# EAGLE design H (EAGLE 9.6.2)
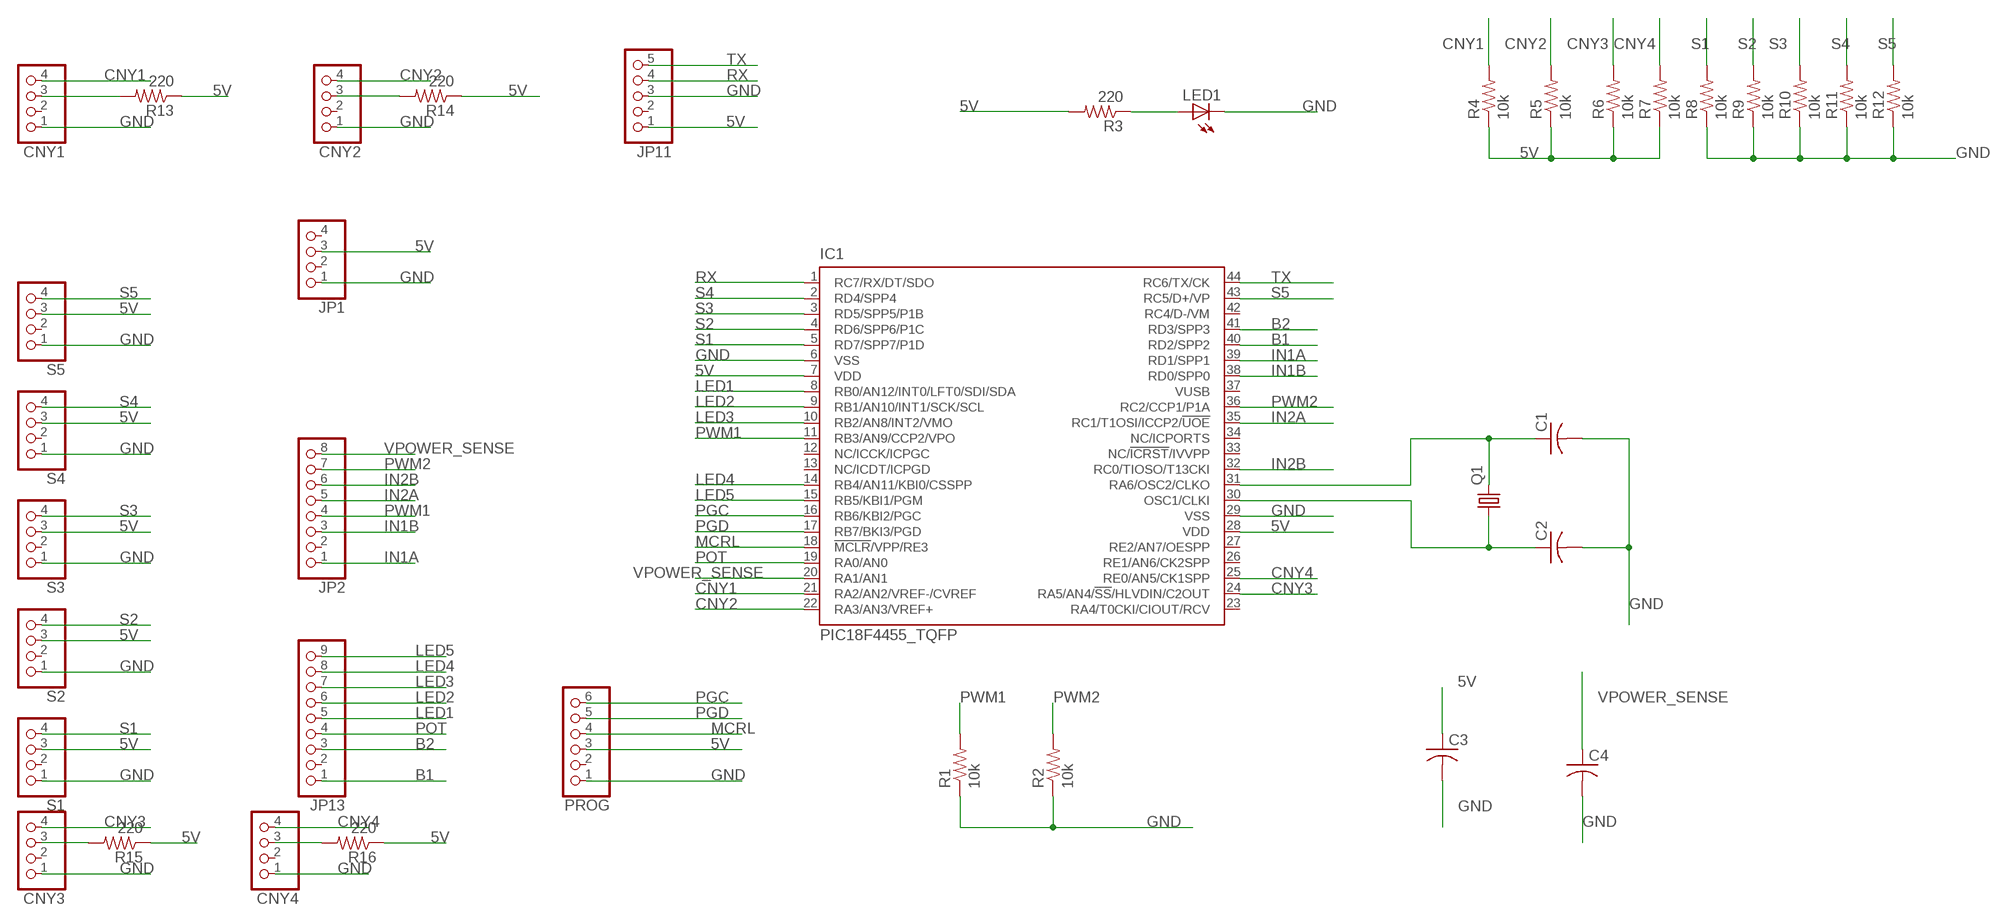
[diagram p0: schematic, sheet 1]

## Parts
C1  C-USC0805K  [C0805K]
C2  C-USC0805K  [C0805K]
C3  C-USC0805K  [C0805K]
C4  C-USC0805K  [C0805K]
CNY1  PINHD-1X4/90  [1X04/90]
CNY2  PINHD-1X4/90  [1X04/90]
CNY3  PINHD-1X4/90  [1X04/90]
CNY4  PINHD-1X4/90  [1X04/90]
IC1  PIC18F4455_TQFP  [TQFP44]
JP1  PINHD-1X4/90  [1X04/90]
JP2  PINHD-1X8/90  [1X08/90]
JP11  PINHD-1X5/90  [1X05/90]
JP13  PINHD-1X9/90  [1X09/90]
LED1  LEDCHIPLED_1206  [CHIPLED_1206]
PROG  PINHD-1X6/90  [1X06/90]
Q1  CRYSTALHC49S  [HC49/S]
R1  10k  R-US_M1206  [M1206]
R2  10k  R-US_M1206  [M1206]
R3  220  R-US_M1206  [M1206]
R4  10k  R-US_M1206  [M1206]
R5  10k  R-US_M1206  [M1206]
R6  10k  R-US_M1206  [M1206]
R7  10k  R-US_M1206  [M1206]
R8  10k  R-US_M1206  [M1206]
R9  10k  R-US_M1206  [M1206]
R10  10k  R-US_M1206  [M1206]
R11  10k  R-US_M1206  [M1206]
R12  10k  R-US_M1206  [M1206]
R13  220  R-US_M1206  [M1206]
R14  220  R-US_M1206  [M1206]
R15  220  R-US_M1206  [M1206]
R16  220  R-US_M1206  [M1206]
S1  PINHD-1X4/90  [1X04/90]
S2  PINHD-1X4/90  [1X04/90]
S3  PINHD-1X4/90  [1X04/90]
S4  PINHD-1X4/90  [1X04/90]
S5  PINHD-1X4/90  [1X04/90]

## Nets
5V: C3.1 IC1.7(VDD) IC1.28(VDD) JP1.3 JP11.1 PROG.3 R3.2 R4.1 R5.1 R6.1 R7.1 R13.1 R14.1 R15.1 R16.1 S1.3 S2.3 S3.3 S4.3 S5.3
B1: IC1.40(RD2/SPP2) JP13.1
B2: IC1.41(RD3/SPP3) JP13.3
CNY1: CNY1.4 IC1.21(RA2/AN2/VREF-/CVREF) R4.2
CNY2: CNY2.4 IC1.22(RA3/AN3/VREF+) R5.2
CNY3: CNY3.4 IC1.24(RA5/AN4/!SS!/HLVDIN/C2OUT) R6.2
CNY4: CNY4.4 IC1.25(RE0/AN5/CK1SPP) R7.2
GND: C1.2 C2.2 C3.2 C4.2 CNY1.1 CNY2.1 CNY3.1 CNY4.1 IC1.6(VSS) IC1.29(VSS) JP1.1 JP11.3 LED1.C PROG.1 R1.1 R2.1 R8.1 R9.1 R10.1 R11.1 R12.1 S1.1 S2.1 S3.1 S4.1 S5.1
IN1A: IC1.39(RD1/SPP1) JP2.1
IN1B: IC1.38(RD0/SPP0) JP2.3
IN2A: IC1.35(RC1/T1OSI/ICCP2/!UOE) JP2.5
IN2B: IC1.32(RC0/TIOSO/T13CKI) JP2.6
LED1: IC1.8(RB0/AN12/INT0/LFT0/SDI/SDA) JP13.5
LED2: IC1.9(RB1/AN10/INT1/SCK/SCL) JP13.6
LED3: IC1.10(RB2/AN8/INT2/VMO) JP13.7
LED4: IC1.14(RB4/AN11/KBI0/CSSPP) JP13.8
LED5: IC1.15(RB5/KBI1/PGM) JP13.9
MCRL: IC1.18(!MCLR!/VPP/RE3) PROG.4
N$1: C1.1 IC1.31(RA6/OSC2/CLKO) Q1.2
N$2: C2.1 IC1.30(OSC1/CLKI) Q1.1
N$3: LED1.A R3.1
N$4: CNY1.3 R13.2
N$5: CNY2.3 R14.2
N$6: CNY3.3 R15.2
N$7: CNY4.3 R16.2
PGC: IC1.16(RB6/KBI2/PGC) PROG.6
PGD: IC1.17(RB7/BKI3/PGD) PROG.5
POT: IC1.19(RA0/AN0) JP13.4
PWM1: IC1.11(RB3/AN9/CCP2/VPO) JP2.4 R1.2
PWM2: IC1.36(RC2/CCP1/P1A) JP2.7 R2.2
RX: IC1.1(RC7/RX/DT/SDO) JP11.4
S1: IC1.5(RD7/SPP7/P1D) R8.2 S1.4
S2: IC1.4(RD6/SPP6/P1C) R9.2 S2.4
S3: IC1.3(RD5/SPP5/P1B) R10.2 S3.4
S4: IC1.2(RD4/SPP4) R11.2 S4.4
S5: IC1.43(RC5/D+/VP) R12.2 S5.4
TX: IC1.44(RC6/TX/CK) JP11.5
VPOWER_SENSE: C4.1 IC1.20(RA1/AN1) JP2.8
Unconnected: CNY1.2 CNY2.2 CNY3.2 CNY4.2 IC1.12(NC/ICCK/ICPGC) IC1.13(NC/ICDT/ICPGD) IC1.23(RA4/T0CKI/CIOUT/RCV) IC1.26(RE1/AN6/CK2SPP) IC1.27(RE2/AN7/OESPP) IC1.33(NC/!ICRST!/IVVPP) IC1.34(NC/ICPORTS) IC1.37(VUSB) IC1.42(RC4/D-/VM) JP1.2 JP1.4 JP2.2 JP11.2 JP13.2 PROG.2 S1.2 S2.2 S3.2 S4.2 S5.2

## Library data of the parts
C1-C4 = adafruit:C-US: CAPACITOR, American symbol
CNY1 CNY2 JP1 S1-S5 = pinhead-enhanced:PINHD-1X4: PIN HEADER
CNY3 CNY4 = pinhead-enhanced-3:PINHD-1X4: PIN HEADER
IC1 = microchip:PIC18F4*_TQFP: USB Microcontrollers with nanoWatt Technology High-Performance, Enhanced Flash, 28/40/44-Pin, Source: http://ww1.microchip.com/downloads/en/devicedoc/39632c.pdf; MF: MICROCHIP; MPN: PIC18F4455-I/PT; OC_FARNELL: 9321322; OC_NEWARK: 08J9628
JP2 = pinhead-enhanced-2:PINHD-1X8: PIN HEADER
JP11 = pinhead-enhanced-3:PINHD-1X5: PIN HEADER
JP13 = pinhead-enhanced-3:PINHD-1X9: PIN HEADER
LED1 = adafruit:LED: LED OSRAM: - CHIPLED LG R971, LG N971, LY N971, LG Q971, LY Q971, LO R971, LY R971 LH N974, LH R974 LS Q976, LO Q976, LY Q976 LO Q996 - Hyper CHIPLED LW Q18S LB Q993, LB Q99A, LB R99A - SideLED LS A670, LO A670, LY A670, LG A670, LP A670 LB A673, LV A673, LT A673, LW A673 LH A674 LY A675 LS A676, LA A676, LO A676, LY A676, LW A676 LS A679, LY A679, LG A679 - Hyper Micro SIDELED® LS Y876, LA Y876, LO Y876, LY Y876 LT Y87S - SmartLED LW L88C, LW L88S LB L89C, LB L89S, LG L890 LS L89K, LO L89K, LY L89K LS L896, LA L896, LO L896, LY L896 - TOPLED LS T670, LO T670, LY T670, LG T670, LP T670 LSG T670, LSP T670, LSY T670, LOP T670, LYG T670 LG T671, LOG T671, LSG T671 LB T673, LV T673, LT T673, LW T673 LH T674 LS T676, LA T676, LO T676, LY T676, LB T676, LH T676, LSB T676, LW T676 LB T67C, LV T67C, LT T67C, LS T67K, LO T67K, LY T67K, LW E67C LS E67B, LA E67B, LO E67B, LY E67B, LB E67C, LV E67C, LT E67C LW T67C LS T679, LY T679, LG T679 LS T770, LO T770, LY T770, LG T770, LP T770 LB T773, LV T773, LT T773, LW T773 LH T774 LS E675, LA E675, LY E675, LS T675 LS T776, LA T776, LO T776, LY T776, LB T776 LHGB T686 LT T68C, LB T68C - Hyper Mini TOPLED® LB M676 - Mini TOPLED Santana® LG M470 LS M47K, LO M47K, LY M47K Source: http://www.osram.convergy.de/
PROG = pinhead-enhanced-2:PINHD-1X6: PIN HEADER
Q1 = crystal:CRYSTAL: CRYSTAL; OC_FARNELL: 1667008; OC_NEWARK: unknown
R1-R16 = adafruit:R-US_: RESISTOR, American symbol

## Board
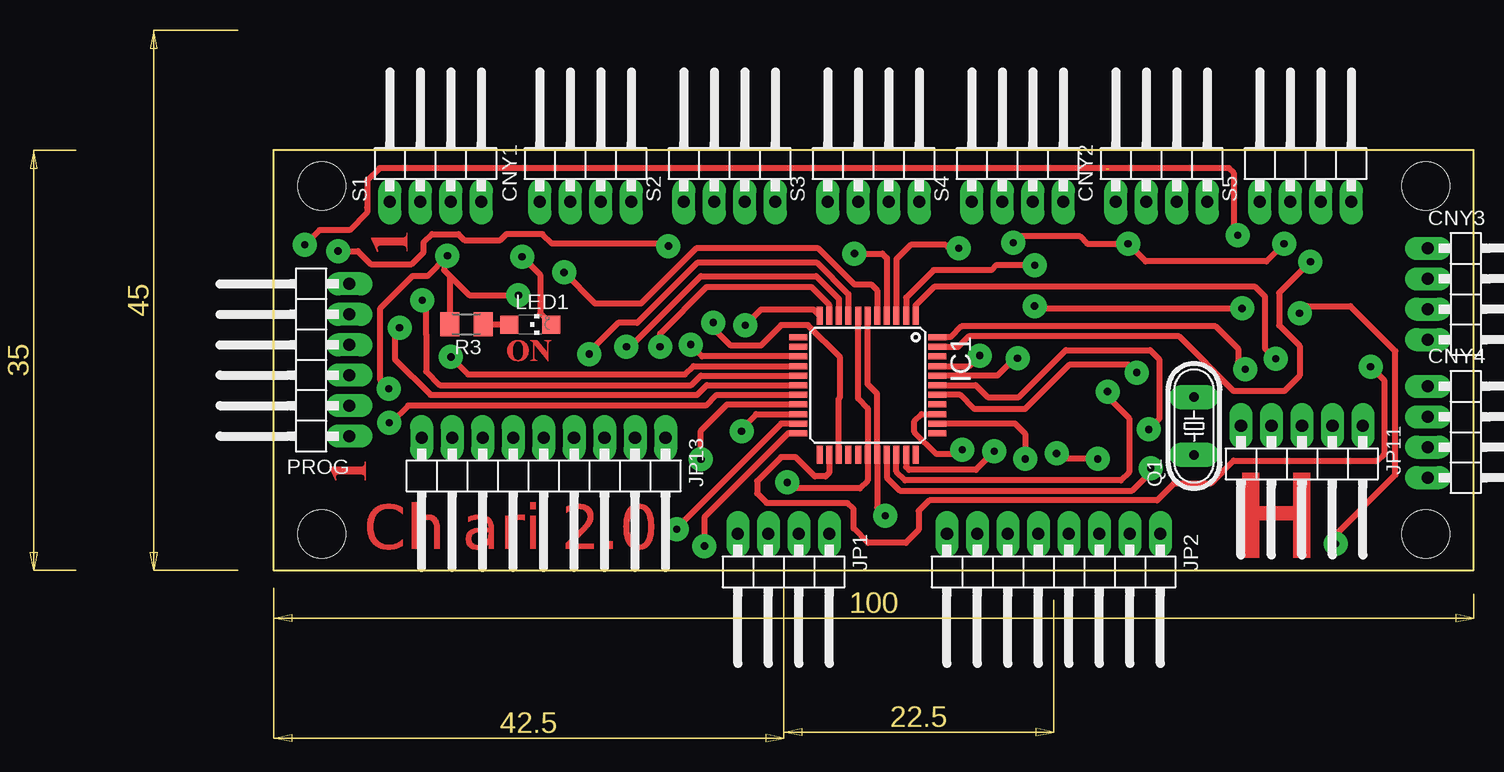
[diagram p1: board, top side]
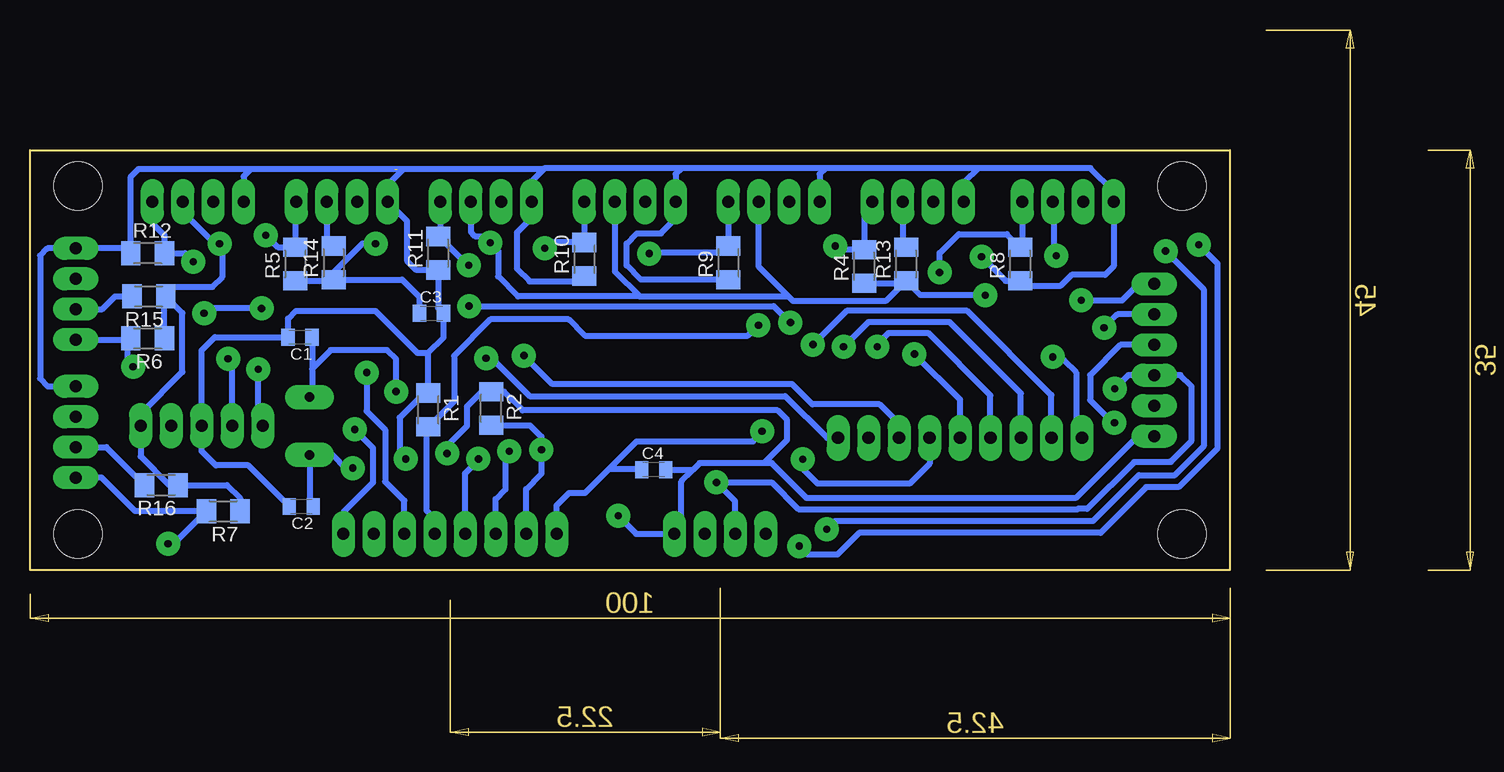
[diagram p2: board, bottom side, seen from below]

Size 100 x 35 mm. Coordinates in mm from the lower left corner, seen from the top.
Outline: 0,0 0,35 100,35 100,0 0,0
Copper layers (1*16): Top 0.035mm / dielectric 1.5mm / Bottom 0.035mm
Design rules "default *": minimum track width 6mil, minimum drill 0.35mm, track to track 6mil, track to pad 6mil, pad to pad 6mil, via to via 6mil, smd to smd 6mil, copper to edge 20mil, drill to drill 6mil, minimum pad ring 10mil, minimum via ring 8mil, stop-mask expansion 4mil, vias tented up to drill 0mil, thermal gap 10mil
Holes 4 mm at 4,32 4,3 96,3 96,32

### Footprints (pad centres in the part's own frame; a part is rotated, then mirrored left to right if it is on the bottom)
C0805K = smd 1.1 x 1.4: 1 -1,0; 2 1,0
1X04/90 = drill 1.016 pad 1.905 long: 1 -3.81,-3.81; 2 -1.27,-3.81; 3 1.27,-3.81; 4 3.81,-3.81
TQFP44 = smd 1.5 x 0.5: 1 -5.8,4; 2 -5.8,3.2; 3 -5.8,2.4; 4 -5.8,1.6; 5 -5.8,0.8; 6 -5.8,0; 7 -5.8,-0.8; 8 -5.8,-1.6; 9 -5.8,-2.4; 10 -5.8,-3.2; 11 -5.8,-4; 23 5.8,-4; 24 5.8,-3.2; 25 5.8,-2.4; 26 5.8,-1.6; 27 5.8,-0.8; 28 5.8,0; 29 5.8,0.8; 30 5.8,1.6; 31 5.8,2.4; 32 5.8,3.2; 33 5.8,4 | smd 0.5 x 1.5: 12 -4,-5.8; 13 -3.2,-5.8; 14 -2.4,-5.8; 15 -1.6,-5.8; 16 -0.8,-5.8; 17 0,-5.8; 18 0.8,-5.8; 19 1.6,-5.8; 20 2.4,-5.8; 21 3.2,-5.8; 22 4,-5.8; 34 4,5.8; 35 3.2,5.8; 36 2.4,5.8; 37 1.6,5.8; 38 0.8,5.8; 39 0,5.8; 40 -0.8,5.8; 41 -1.6,5.8; 42 -2.4,5.8; 43 -3.2,5.8; 44 -4,5.8
1X08/90 = drill 1.016 pad 1.905 long: 1 -8.89,-3.81; 2 -6.35,-3.81; 3 -3.81,-3.81; 4 -1.27,-3.81; 5 1.27,-3.81; 6 3.81,-3.81; 7 6.35,-3.81; 8 8.89,-3.81
1X05/90 = drill 1.016 pad 1.905 long: 1 -5.08,-3.81; 2 -2.54,-3.81; 3 0,-3.81; 4 2.54,-3.81; 5 5.08,-3.81
1X09/90 = drill 1.016 pad 1.905 long: 1 -10.16,-3.81; 2 -7.62,-3.81; 3 -5.08,-3.81; 4 -2.54,-3.81; 5 0,-3.81; 6 2.54,-3.81; 7 5.08,-3.81; 8 7.62,-3.81; 9 10.16,-3.81
CHIPLED_1206 = smd 1.5 x 1.5: A 0,-1.75; C 0,1.75
1X06/90 = drill 1.016 pad 1.905 long: 1 -6.35,-3.81; 2 -3.81,-3.81; 3 -1.27,-3.81; 4 1.27,-3.81; 5 3.81,-3.81; 6 6.35,-3.81
HC49/S = drill 0.813 pad 2.032 long: 1 -2.413,0; 2 2.413,0
M1206 = smd 1.6 x 2: 1 -1.4,0; 2 1.4,0

### Placement (x,y rotation side)
C1  77.5,19.4 180 bottom
C2  77.4,5.3 180 bottom
C3  66.54,21.39 0 bottom
C4  48.03,8.36 0 bottom
CNY1  26,34.5 0 top
CNY2  74,34.5 0 top
CNY3  100,23 270 top
CNY4  100,11.5 270 top
IC1  49.5,15.4 270 top
JP1  42.5,-0.8 180 top
JP2  65,-0.8 180 top
JP11  85.7,8.22 180 top
JP13  22.5,7.2 180 top
LED1  21.38,20.46 270 top
PROG  2.5,17.5 90 top
Q1  76.7,12 90 top
R1  66.81,13.34 270 bottom
R2  61.58,13.46 270 bottom
R3  16.07,20.49 180 top
R4  30.5,25.3 90 bottom
R5  77.9,25.5 90 bottom
R6  90.2,19.3 180 bottom
R7  83.9,4.9 180 bottom
R8  17.5,25.5 90 bottom
R9  41.8,25.6 90 bottom
R10  53.8,25.9 90 bottom
R11  66,26.4 90 bottom
R12  90.2,26.4 0 bottom
R13  27,25.5 90 bottom
R14  74.7,25.6 90 bottom
R15  90.1,22.8 180 bottom
R16  89.07,7.08 180 bottom
S1  13.5,34.5 0 top
S2  38,34.5 0 top
S3  50,34.5 0 top
S4  62,34.5 0 top
S5  86,34.5 0 top

### Tracks (layer width: path | path; a pad name or v marks a point on that pad's centre or on a via)
5V  (via drill 0.6 pad 2)
  Top 0.5: IC1.7 48.7,14.3 49.5,13.5 IC1.28 49.5,7.45 48.85,6.8 43.3,6.8 v42.8,7.3 | 14.67,24.53 R3.2 | 14.67,24.53 14.2,25 14.2,26.19 v14.49,26.19 12.79,24.49 11.57,24.49 8.9,21.82 8.9,15.8 v9.6,15.1 | 14.67,24.53 16.3,22.9 v20.4,22.9 | v61.64,27.27 62.17,27.8 67.2,27.8 67.8,27.2 v71.2,27.2 72.67,25.73 82.73,25.73 v84.2,27.2
  Bottom 0.5: S5.3 87.27,29.87 84.4,27 v84.2,27.2 84,27.2 84,24.4 84.8,23.6 87.9,23.6 R15.1 87.3,21.4 87.3,16.52 90.78,13.04 JP11.1 90.78,9.47 88.38,7.08 R16.1 | JP1.3 41.23,5.73 v42.8,7.3 38.2,7.3 35.97,5.07 12.7,5.07 12.68,5.1 11.9,5.1 8,9 4.9,9 4.9,9.07 3.2,10.78 3.2,15.3 4.13,16.23 PROG.3 8.47,16.23 v9.6,15.1 | v14.49,26.19 14.69,26.39 14.69,30.61 S1.3 | v20.4,22.9 25.8,22.9 R13.1 28.7,22.4 36.4,22.4 36.8,22.8 | S2.3 39.27,25.27 36.8,22.8 | S3.3 51.27,24.87 49.2,22.8 | 49.2,22.8 36.8,22.8 | C3.1 67.54,22.74 69,24.2 R14.1 75.3,24.2 72.3,27.2 v71.2,27.2 | S4.3 63.27,28.17 62.93,27.83 62.2,27.83 v61.64,27.27 61,26.63 61,24.46 59.34,22.8 49.2,22.8
  Bottom 0.508: R4.1 27.2,23.9 R13.1 | R5.1 74.8,24.1 R14.1 | R6.1 88.8,22.7 R15.1 | R16.1 83.58,7.08 82.5,6 R7.1
B1  (via drill 0.6 pad 2)
  Top 0.5: v62,17.65 61.76,17.65 60.31,16.2 IC1.40
  Bottom 0.5: JP13.1 33.58,11.01 37.07,14.5 58.37,14.5 61.52,17.65 v62,17.65
B2  (via drill 0.6 pad 2)
  Top 0.5: IC1.41 57.97,17 v58.84,17.88
  Bottom 0.5: JP13.3 27.58,12.18 29.2,13.8 34.8,13.8 36.5,15.5 56.47,15.5 v58.84,17.88
CNY1  (via drill 0.6 pad 2)
  Top 0.5: IC1.21 42.3,12.2 33.6,3.5 v33.6,3.4 | v5.37,26.58 7.02,26.58 8.1,25.5 11.5,25.5 12.5,26.5 12.5,27.3 13.2,28 15.4,28 15.9,27.5 18.9,27.5 19.4,28 22.4,28 23.2,27.2 32.7,27.2 v32.9,27
  Bottom 0.5: CNY1.4 30.5,30 R4.2 32.6,26.7 v32.9,27 | v33.6,3.4 32.9,4.1 11.4,4.1 7.6,7.9 4.6,7.9 2.2,10.3 2.2,23.4 v5.37,26.58
CNY2  (via drill 0.6 pad 2)
  Top 0.5: IC1.22 42.9,11.4 35.89,4.39 v35.89,2.01 v35.9,2 | 7.8,30.2 7.84,30.24 | v80.35,27.9 80.35,28.25 80,28.6 80,33.1 79.6,33.5 8.83,33.5 7.8,32.47 7.8,30.2 | v2.6,27.1 3.83,28.32 6.33,28.32 7.8,29.8 7.8,30.2
  Bottom 0.5: CNY2.4 77.9,30.6 R5.2 79.35,26.9 v80.35,27.9 | v35.9,2 35.2,1.3 32.7,1.3 30.9,3.1 10.79,3.1 6.99,6.9 4.29,6.9 1.03,10.15 1.03,25.53 v2.6,27.1
CNY3  (via drill 0.6 pad 2)
  Top 0.5: v91.42,16.94 92.54,15.82 92.54,9.66 91.98,9.11 79.99,9.11 78.12,7.24 75.06,7.24 73.63,5.81 54.65,5.81 53.76,4.92 53.76,3.35 52.68,2.27 49.53,2.27 48.33,3.47 48.33,5.09 47.82,5.6 41.08,5.6 40.3,6.38 40.3,7.4 42.3,9.4 43.5,9.4 45.1,7.8 46,7.8 46.3,8.1 IC1.24
  Bottom 0.5: CNY3.4 91.71,19.19 R6.2 91.9,19 91.9,17.43 v91.42,16.94
CNY4  (via drill 0.6 pad 2)
  Top 0.5: v88.49,2.18 88.49,2.94 93.49,7.93 93.49,18.24 89.72,22 86.1,22 v85.5,21.4 | IC1.25 47.1,14.3 47.2,14.4 47.2,17.73 44.52,20.4 42.3,20.4 40.6,18.7 38.1,18.7 36.4,20.4 v36.63,20.62 | v63.41,22 63.61,21.8 v80.7,21.8
  Bottom 0.5: 95.59,7.69 CNY4.4 94.03,7.69 91.24,4.9 R7.2 | 85.3,5.2 R7.2 | R7.2 88.02,2.18 v88.49,2.18 | v36.63,20.62 36.66,20.62 38.03,22 v63.41,22 | v80.7,21.8 85.1,21.8 v85.5,21.4
GND  (via drill 0.6 pad 2)  (1 unrouted)
  Top 0.5: IC1.6 49.5,15.5 50.3,14.7 IC1.29 50.3,5.2 v50.98,4.52 | LED1.C 22.2,21.38 22.2,24.6 v20.7,26.1
  Top 0.508: v68.68,9.26 65.7,9.26 v65.25,9.71
  Bottom 0.5: 61.77,15.05 R2.1 | R1.1 66.31,15.24 | 61.68,14.96 R2.1 | JP11.3 85.69,18.3 84.6,19.4 C1.2 78.47,19.43 | PROG.1 7.71,11.15 12.86,6 35.27,6 38.17,8.9 38.84,8.9 | 38.84,8.9 44.2,8.9 44.74,8.36 | R8.1 17.3,24.3 | 21,33.5 11.64,33.5 9.69,31.55 S1.1 9.69,25.31 10.4,24.6 13.2,24.6 14.1,23.7 17.1,23.7 R8.1 | CNY1.1 22.19,32.31 21,33.5 | 21,33.5 33.7,33.5 | S2.1 34.19,33.01 33.7,33.5 | 33.7,33.5 45.7,33.5 | 45.7,33.5 46.19,33.01 S3.1 46.19,29.29 47.44,28.05 49.43,28.05 50.28,27.2 50.28,25.38 49.1,24.2 R9.1 | 45.7,33.5 57.1,33.5 57.2,33.4 | 57.2,33.4 58.19,32.41 S4.1 58.19,29.35 59.42,28.12 59.42,25.12 58.36,24.06 54.24,24.06 R10.1 | 57.2,33.4 68.9,33.4 | 68.9,33.4 69.6,33.4 | 69.4,33.4 81.6,33.4 | S5.1 82.19,32.81 81.6,33.4 | 81.6,33.4 90.96,33.4 91.64,32.72 91.64,26.44 R12.1 92.01,26.81 CNY3.1 98.56,26.81 99.17,26.2 99.17,15.97 98.51,15.31 CNY4.1 | v20.7,26.1 18.7,24.1 R8.1 | R11.1 67.8,25 68.59,25.79 68.59,29.09 CNY2.1 70.19,32.11 68.9,33.4 | R1.1 66.81,18.1 65.54,19.37 C3.2 66,21.85 R11.1 | 65.6,24.6 R11.1 | v50.98,4.52 49.48,3.02 JP1.1 45.71,3.61 45.71,7.39 44.74,8.36 | R2.1 60.51,14.86 58.96,13.3 37.7,13.3 36.9,12.51 36.9,10.84 38.84,8.9 | R2.1 62.35,14.86 63.6,13.61 63.6,11.99 65.25,10.34 v65.25,9.71 | R1.1 67.15,14.74 69.2,12.69 69.2,9.81 68.68,9.29 v68.68,9.26 | C4.2 44.74,8.36
  Bottom 0.508: C2.2 81.81,8.71 84.51,8.71 85.69,9.9 JP11.3 | C1.2 78.5,20.94 77.85,21.59 71.22,21.59 67.73,18.1 66.81,18.1
IN1A  (via drill 0.6 pad 2)
  Top 0.5: v72.93,11.71 73.8,12.58 73.8,17.58 73.05,18.33 66.03,18.33 62.1,14.4 59.5,14.4 58.5,15.4 IC1.39
  Bottom 0.5: JP2.1 73.89,4.81 71.4,7.3 71.4,10.16 72.93,11.69 v72.93,11.71
IN1B  (via drill 0.6 pad 2)
  Top 0.5: v71.94,16.45 71.29,17.1 66.3,17.1 62.6,13.4 58.4,13.4 57.2,14.6 IC1.38
  Bottom 0.5: v71.94,16.45 71.94,13.24 70.4,11.7 70.4,7.36 68.81,5.77 JP2.3
IN2A  (via drill 0.6 pad 2)
  Top 0.5: IC1.35 61.8,12.2 62.63,11.37 v62.63,9.26
  Bottom 0.5: JP2.5 63.73,8.05 62.63,9.14 v62.63,9.26
IN2B  (via drill 0.6 pad 2)
  Top 0.5: IC1.32 52.7,8.6 52.96,8.34 58.52,8.34 v60.06,9.89
  Bottom 0.5: JP2.6 61.19,5.91 60.39,6.71 60.39,9.89 v60.06,9.89
LED1  (via drill 0.6 pad 2)
  Top 0.5: v26.3,18 26.3,18.2 28.7,20.6 30.3,20.6 35.3,25.6 45.3,25.6 47.9,23 IC1.8
  Bottom 0.5: JP13.5 22.5,14.2 v26.3,18
LED2  (via drill 0.6 pad 2)
  Top 0.5: v29.4,18.6 29.7,18.6 35.6,24.5 45.2,24.5 47.1,22.6 IC1.9
  Bottom 0.5: JP13.6 19.96,14.56 25.15,19.75 28.45,19.75 29.4,18.8 v29.4,18.6
LED3  (via drill 0.6 pad 2)
  Top 0.5: v32.2,18.6 32.2,19.7 36.1,23.6 44.8,23.6 46.3,22.1 IC1.10
  Bottom 0.5: JP13.7 17.42,14.72 23.38,20.68 30.12,20.68 v32.2,18.6
LED4  (via drill 0.6 pad 2)
  Top 0.5: IC1.14 35.7,17.8 34.73,18.77 v34.76,18.79
  Bottom 0.5: JP13.8 14.88,14.58 21.9,21.6 31.95,21.6 v34.76,18.79
LED5  (via drill 0.6 pad 2)
  Top 0.5: v14.78,17.76 14.78,17.72 16.2,16.3 34.3,16.3 35,17 IC1.15
  Bottom 0.5: JP13.9 12.82,11.49 12.82,16.48 13.84,17.5 14.78,17.5 v14.78,17.76
MCRL  (via drill 0.6 pad 2)
  Top 0.5: v9.63,12.28 9.78,12.28 11.2,13.7 36,13.7 36.9,14.6 IC1.18
  Bottom 0.5: PROG.4 9.13,18.77 11.66,16.24 11.66,14.16 9.78,12.28 v9.63,12.28
N$1  (via drill 0.6 pad 2)
  Top 0.5: IC1.31 51.9,8.2 52.63,7.47 70.6,7.47 71.3,8.17 71.3,12.64 69.5,14.45 v69.5,14.87
  Bottom 0.5: Q1.2 76.7,14.5 76.5,14.7 76.5,16.77 | v69.5,14.87 69.5,17.57 70.25,18.33 74.94,18.33 76.5,16.77 | C1.1 76.5,16.77
N$2  (via drill 0.6 pad 2)
  Top 0.5: IC1.30 51.1,7.7 52.2,6.61 71.55,6.61 73.1,8.15 v73.1,8.5
  Bottom 0.5: C2.1 76.7,5.6 Q1.1 74.79,9.59 73.7,8.5 v73.1,8.5
N$3
  Top 0.5: R3.1 19.59,20.49 LED1.A
N$4
  Bottom 0.5: CNY1.3 27.27,27.17 R13.2
N$5
  Bottom 0.5: CNY2.3 75.27,27.57 R14.2
N$6
  Bottom 0.5: CNY3.3 93.97,21.73 92.9,22.8 R15.2
N$7
  Bottom 0.5: CNY4.3 93.63,10.23 R16.2
PGC  (via drill 0.6 pad 2)
  Top 0.5: v12.39,22.48 12.69,22.17 12.69,19.66 12.71,19.64 12.71,16.55 13.85,15.4 34.8,15.4 35.6,16.2 IC1.16
  Bottom 0.5: PROG.6 7.62,23.85 8.99,22.48 v12.39,22.48
PGD  (via drill 0.6 pad 2)
  Top 0.5: v10.5,20.2 10.1,19.8 10.1,17.58 13.08,14.6 35.3,14.6 36.1,15.4 IC1.17
  Bottom 0.5: PROG.5 9.39,21.31 v10.5,20.2
POT  (via drill 0.6 pad 2)
  Top 0.5: v35.61,9.24 35.61,11.61 37.8,13.8 IC1.19
  Bottom 0.5: JP13.4 25.04,8.86 26.7,7.2 34.37,7.2 35.61,8.44 v35.61,9.24
PWM1  (via drill 0.6 pad 2)
  Top 0.5: IC1.11 45,21.7 40.6,21.7 v39.3,20.4
  Bottom 0.5: 66.38,11.51 R1.2 | v39.3,20.4 40.17,19.53 53.77,19.53 55.12,20.88 61.63,20.88 64.67,17.84 64.67,14.05 66.78,11.94 R1.2 | JP2.4 66.27,4.27 66.95,4.95 66.95,11.81 R1.2
PWM2  (via drill 0.6 pad 2)
  Top 0.5: v57.38,10.02 57.38,9.94 57.09,9.65 55.25,9.65 53.4,11.5 53.4,12.4 54,13 IC1.36
  Bottom 0.5: JP2.7 58.65,6.75 57.38,8.02 v57.38,10.01 v57.38,10.02 57.38,11.11 58.34,12.06 R2.2
RX  (via drill 0.6 pad 2)
  Top 0.5: IC1.1 53.5,22.05 55.05,23.6 81.8,23.6 82.6,22.8 82.6,18.5 v83.5,17.6
  Bottom 0.5: JP11.4 83.16,17.25 v83.5,17.6
S1  (via drill 0.6 pad 2)
  Top 0.5: IC1.5 50.3,23.3 49.8,23.8 48.4,23.8 45.4,26.8 35.2,26.8 30.6,22.2 26.8,22.2 v24.2,24.8
  Bottom 0.5: S1.4 17.31,27.09 R8.2 18.6,28 22.6,28 24.2,26.4 v24.2,24.8
S2  (via drill 0.6 pad 2)
  Top 0.5: v48.4,26.37 50.73,26.37 51.1,26 IC1.4
  Bottom 0.5: S2.4 R9.2 42.33,26.48 48.3,26.48 v48.4,26.37
S3  (via drill 0.6 pad 2)
  Top 0.5: v57.1,26.8 56.3,26.8 56,27.1 53.1,27.1 51.9,25.9 IC1.3
  Bottom 0.5: S3.4 R10.2 56.6,27.3 v57.1,26.8
S4  (via drill 0.6 pad 2)
  Top 0.5: v63.43,25.4 60.23,25.4 59.83,25 55,25 52.7,22.7 IC1.2
  Bottom 0.5: S4.4 65.81,27.99 R11.2 65.95,27.8 63.49,25.34 v63.43,25.4
S5  (via drill 0.6 pad 2)
  Top 0.5: IC1.43 57.05,18.6 57.92,19.48 75.45,19.48 80.02,14.9 84.2,14.9 85.5,16.2 85.5,18.68 83.8,20.38 83.8,23.1 v86.4,25.7
  Bottom 0.5: S5.4 89.81,28.91 88.8,27.9 R12.2 87.1,26.4 v86.4,25.7
TX  (via drill 0.6 pad 2)
  Top 0.5: IC1.44 56.42,19.4 57.32,20.3 78.5,20.3 80.38,18.42 80.38,17.34 v80.98,16.74
  Bottom 0.5: v80.98,16.74 80.68,16.44 80.68,16.14 81.02,15.8 81.02,12.43 JP11.5
VPOWER_SENSE  (via drill 0.6 pad 2)
  Top 0.5: v39,11.56 39,11.8 40.2,13 IC1.20
  Bottom 0.5: v39,11.56 39,11.48 39.77,10.71 49.45,10.71 51.77,8.39 | 51.77,8.39 53.74,6.42 55.07,6.42 56.11,5.38 JP2.8 | C4.1 49.06,8.39 51.77,8.39
(copper drawn outside any net)
  shapes: Top area x3069

### Text on the board
200bmp: C:/Users/Ariel/GitHub/Sumo-Robot-Programs-Database/boards/mejoras/I/1.bmp | C:/Users/Ariel/GitHub/Sumo-Robot-Programs-Database/boards/mejoras/I/ON.bmp | C:/Users/Ariel/GitHub/Sumo-Robot-Programs-Database/boards/mejoras/I/chiari.bmp | C:/Users/Ariel/GitHub/Sumo-Robot-Programs-Database/boards/mejoras/I/chiari.bmp | C:/Users/Ariel/GitHub/Sumo-Robot-Programs-Database/boards/mejoras/I/chiari.bmp